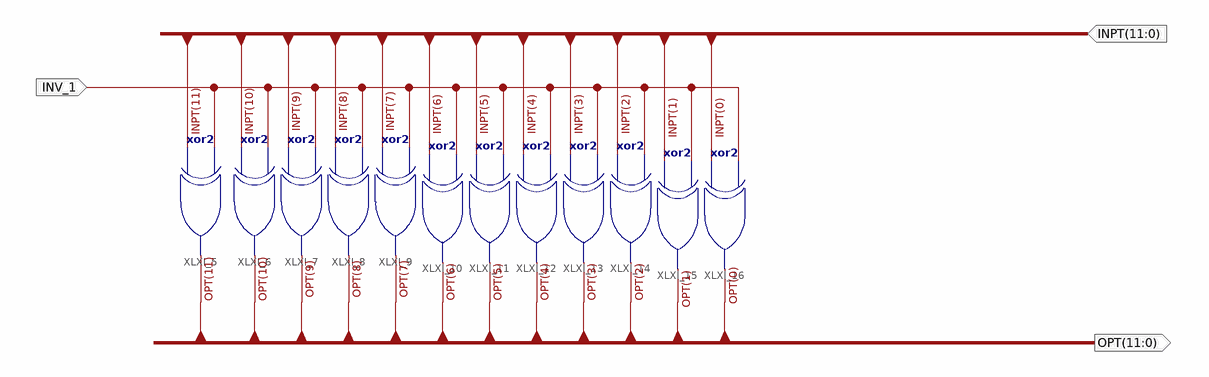
[diagram p0: schematic sheet 1]
// Xilinx ISE schematic Inverter_12_op.sch (spartan3) as structural Verilog: 12 symbols, 3 ports
module Inverter_12_op (
  input  [11:0] INPT,
  input  INV_1,
  output [11:0] OPT
);

  xor XLXI_5 (OPT[11], INPT[11], INV_1);
  xor XLXI_6 (OPT[10], INPT[10], INV_1);
  xor XLXI_7 (OPT[9], INPT[9], INV_1);
  xor XLXI_8 (OPT[8], INPT[8], INV_1);
  xor XLXI_9 (OPT[7], INPT[7], INV_1);
  xor XLXI_10 (OPT[6], INPT[6], INV_1);
  xor XLXI_11 (OPT[5], INPT[5], INV_1);
  xor XLXI_12 (OPT[4], INPT[4], INV_1);
  xor XLXI_13 (OPT[3], INPT[3], INV_1);
  xor XLXI_14 (OPT[2], INPT[2], INV_1);
  xor XLXI_15 (OPT[1], INPT[1], INV_1);
  xor XLXI_16 (OPT[0], INPT[0], INV_1);
endmodule
